# Altium schematic sheet Machine interlock controller.SchDoc: Machine interlock controller
size A3; Author: Peake J; CompanyName: Scion Research; DrawnBy: Peake J; Engineer: Peake J; Organization: Scion; Address1: 49 Sala St; Address2: Whakarewarewa; Address3: Rotorua; Address4: New Zealand 3010; DocumentNumber: N/A; Revision: 0; SheetNumber: 1; SheetTotal: 1
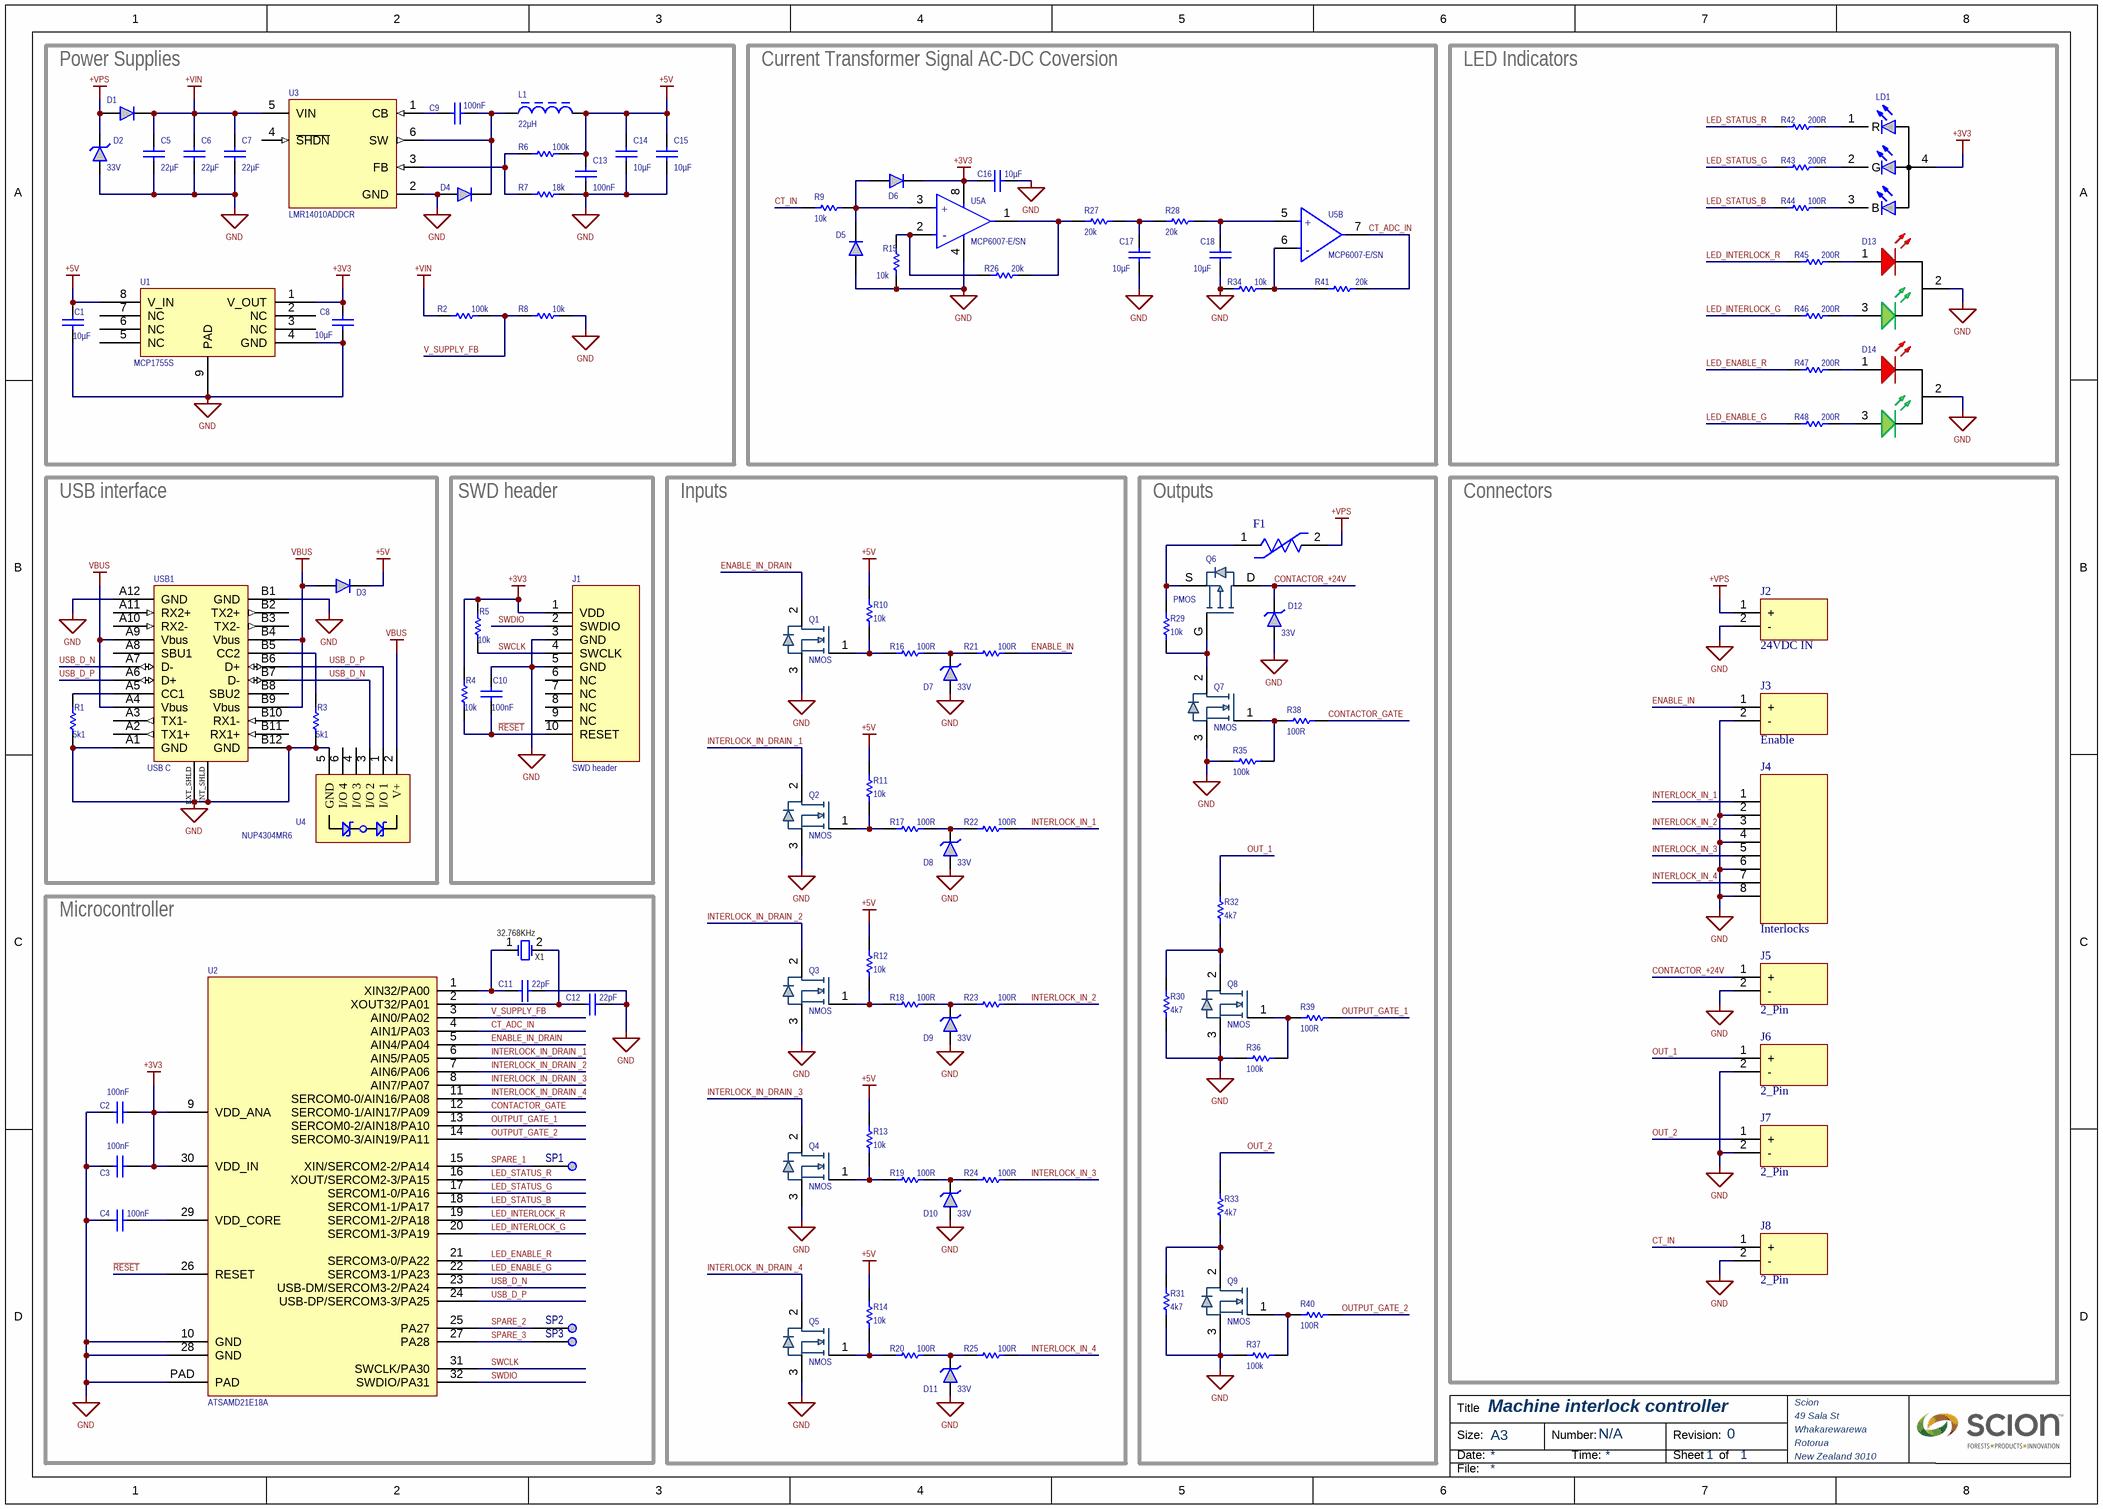
[diagram p0: Machine interlock controller.SchDoc]

## Parts
C1  value 10µF  [0603_CAP]  (hidden comment: Capacitor)
C2  value 100nF  [0603_CAP]  (hidden comment: Capacitor)
C3  value 100nF  [0603_CAP]  (hidden comment: Capacitor)
C4  value 100nF  [0603_CAP]  (hidden comment: Capacitor)
C5  value 22µF  [0805_CAP]  (hidden comment: Capacitor)
C6  value 22µF  [0805_CAP]  (hidden comment: Capacitor)
C7  value 22µF  [0805_CAP]  (hidden comment: Capacitor)
C8  value 10µF  [0603_CAP]  (hidden comment: Capacitor)
C9  value 100nF  [0603_CAP]  (hidden comment: Capacitor)
C10  value 100nF  [0603_CAP]  (hidden comment: Capacitor)
C11  value 22pF  [0603_CAP]  (hidden comment: Capacitor)
C12  value 22pF  [0603_CAP]  (hidden comment: Capacitor)
C13  value 100nF  [0603_CAP]  (hidden comment: Capacitor)
C14  value 10µF  [0603_CAP]  (hidden comment: Capacitor)
C15  value 10µF  [0603_CAP]  (hidden comment: Capacitor)
C16  value 10µF  [0603_CAP]  (hidden comment: Capacitor)
C17  value 10µF  [0603_CAP]  (hidden comment: Capacitor)
C18  value 10µF  [0603_CAP]  (hidden comment: Capacitor)
D1  Diode  [SOD-123]  (value not drawn)
D2  Rated Voltage: 33V  [SMBJ]  (hidden comment: Transil)
D3  Diode  [SOD-123]  (value not drawn)
D4  Diode  [SOD-123]  (value not drawn)
D5  Diode  [SOD-523]  (value not drawn)
D6  Diode  [SOD-523]  (value not drawn)
D7  Rated Voltage: 33V  [SMBJ]  (hidden comment: Transil)
D8  Rated Voltage: 33V  [SMBJ]  (hidden comment: Transil)
D9  Rated Voltage: 33V  [SMBJ]  (hidden comment: Transil)
D10  Rated Voltage: 33V  [SMBJ]  (hidden comment: Transil)
D11  Rated Voltage: 33V  [SMBJ]  (hidden comment: Transil)
D12  Rated Voltage: 33V  [SMBJ]  (hidden comment: Transil)
D13  LED 3mm Bi-colour  [LED 3mm Bi-colour-Footprint-1]  (value not drawn)
D14  LED 3mm Bi-colour  [LED 3mm Bi-colour-Footprint-1]  (value not drawn)
F1  0ZCF0100AF2A  [FP-0ZCF0100AF2A-MFG]  (value not drawn)
J1  SWD header  [DIP10_1.27_M_SMD]
J2  24VDC IN  [2P 3.81mm Header Plugable]
J3  Enable  [2P 3.81mm Header Plugable]
J4  Interlocks  [8P 3.81mm Header Plugable]
J5  2_Pin  [2P 3.81mm Header Plugable]
J6  2_Pin  [2P 3.81mm Header Plugable]
J7  2_Pin  [2P 3.81mm Header Plugable]
J8  2_Pin  [2P 3.81mm Header Plugable]
L1  value 22µH  [BOUR-SRN8040_V]  (hidden comment: Inductor)
LD1  LED_RGB_CA  [LED_RGB_CA]  (value not drawn)
Q1  NMOS  [SOT-23]
Q2  NMOS  [SOT-23]
Q3  NMOS  [SOT-23]
Q4  NMOS  [SOT-23]
Q5  NMOS  [SOT-23]
Q6  PMOS  [PowerDI 5060-8]
Q7  NMOS  [SOT-23]
Q8  NMOS  [SOT-23]
Q9  NMOS  [SOT-23]
R1  value 5k1  [0603_RES]  (hidden comment: Resistor)
R2  value 100k  [0603_RES]  (hidden comment: Resistor)
R3  value 5k1  [0603_RES]  (hidden comment: Resistor)
R4  value 10k  [0603_RES]  (hidden comment: Resistor)
R5  value 10k  [0603_RES]  (hidden comment: Resistor)
R6  value 100k  [0603_RES]  (hidden comment: Resistor)
R7  value 18k  [0603_RES]  (hidden comment: Resistor)
R8  value 10k  [0603_RES]  (hidden comment: Resistor)
R9  value 10k  [0603_RES]  (hidden comment: Resistor)
R10  value 10k  [0603_RES]  (hidden comment: Resistor)
R11  value 10k  [0603_RES]  (hidden comment: Resistor)
R12  value 10k  [0603_RES]  (hidden comment: Resistor)
R13  value 10k  [0603_RES]  (hidden comment: Resistor)
R14  value 10k  [0603_RES]  (hidden comment: Resistor)
R15  value 10k  [0603_RES]  (hidden comment: Resistor)
R16  value 100R  [0603_RES]  (hidden comment: Resistor)
R17  value 100R  [0603_RES]  (hidden comment: Resistor)
R18  value 100R  [0603_RES]  (hidden comment: Resistor)
R19  value 100R  [0603_RES]  (hidden comment: Resistor)
R20  value 100R  [0603_RES]  (hidden comment: Resistor)
R21  value 100R  [0603_RES]  (hidden comment: Resistor)
R22  value 100R  [0603_RES]  (hidden comment: Resistor)
R23  value 100R  [0603_RES]  (hidden comment: Resistor)
R24  value 100R  [0603_RES]  (hidden comment: Resistor)
R25  value 100R  [0603_RES]  (hidden comment: Resistor)
R26  value 20k  [0603_RES]  (hidden comment: Resistor)
R27  value 20k  [0603_RES]  (hidden comment: Resistor)
R28  value 20k  [0603_RES]  (hidden comment: Resistor)
R29  value 10k  [0603_RES]  (hidden comment: Resistor)
R30  value 4k7  [0603_RES]  (hidden comment: Resistor)
R31  value 4k7  [0603_RES]  (hidden comment: Resistor)
R32  value 4k7  [0603_RES]  (hidden comment: Resistor)
R33  value 4k7  [0603_RES]  (hidden comment: Resistor)
R34  value 10k  [0603_RES]  (hidden comment: Resistor)
R35  value 100k  [0603_RES]  (hidden comment: Resistor)
R36  value 100k  [0603_RES]  (hidden comment: Resistor)
R37  value 100k  [0603_RES]  (hidden comment: Resistor)
R38  value 100R  [0603_RES]  (hidden comment: Resistor)
R39  value 100R  [0603_RES]  (hidden comment: Resistor)
R40  value 100R  [0603_RES]  (hidden comment: Resistor)
R41  value 20k  [0603_RES]  (hidden comment: Resistor)
R42  value 200R  [0603_RES]  (hidden comment: Resistor)
R43  value 200R  [0603_RES]  (hidden comment: Resistor)
R44  value 100R  [0603_RES]  (hidden comment: Resistor)
R45  value 200R  [0603_RES]  (hidden comment: Resistor)
R46  value 200R  [0603_RES]  (hidden comment: Resistor)
R47  value 200R  [0603_RES]  (hidden comment: Resistor)
R48  value 200R  [0603_RES]  (hidden comment: Resistor)
SP1  CMP-00044-2  [Prog Pad 1.5 x 2.5mm]  (value not drawn)
SP2  CMP-00044-2  [Prog Pad 1.5 x 2.5mm]  (value not drawn)
SP3  CMP-00044-2  [Prog Pad 1.5 x 2.5mm]  (value not drawn)
U1  MCP1755S  [8P 2x3 DFN]
U2  ATSAMD21E18A  [32P QFN]
U3  LMR14010ADDCR  [FP-DDC0006A-IPC_A]
U4  NUP4304MR6  [TSOP-6]
U5  MCP6007-E/SN  [FP-C04-057-SN-IPC_A]  (parts A,B of 2)
USB1  USB C  [GT-USB-7090A]
X1  32.768KHz  [ABRA-ABS07-2_V]

## Blocks framed on the sheet
Power Supplies: C1 C5-C9 C13-C15 D1 D2 D4 L1 R2 R6-R8 U1 U3
Current Transformer Signal AC-DC Coversion: C16-C18 D5 D6 R9 R15 R26-R28 R34 R41 U5
LED Indicators: D13 D14 LD1 R42-R48
USB interface: D3 R1 R3 U4 USB1
SWD header: C10 J1 R4 R5
Inputs: D7-D11 Q1-Q5 R10-R14 R16-R25
Outputs: D12 F1 Q6-Q9 R29-R33 R35-R40
Connectors: J2-J8
Microcontroller: C2-C4 C11 C12 SP1-SP3 U2 X1

## Nets
+3V3: C2.1 C3.1 C8.1 C16.1 D6.1(K) J1.1(VDD) LD1.4(A) R4.1 R5.1 U1.1(V_OUT) U2.9(VDD_ANA) U2.30(VDD_IN) U5.8(VDD)
+5V: C1.1 C13.1 C14.1 C15.1 D3.1(K) L1.2 R6.2 R10.1 R11.1 R12.1 R13.1 R14.1 U1.8(V_IN)
+VIN: C5.1 C6.1 C7.1 D1.1(K) R2.1 U3.5(VIN)
+VPS: D1.2(A) D2.2(K) F1.2 J2.1(+)
GND: C1.2 C2.2 C3.2 C4.2 C5.2 C6.2 C7.2 C8.2 C10.1 C11.1 C12.2 C13.2 C14.2 C15.2 C16.2 C17.2 C18.2 D2.1(A) D4.2(A) D5.2(A) D7.1(A) D8.1(A) D9.1(A) D10.1(A) D11.1(A) D12.1(A) D13.2(Cathode) D14.2(Cathode) J1.3(GND) J1.5(GND) J2.2(-) J3.2(-) J4.2 J4.4 J4.6 J4.8 J5.2(-) J6.2(-) J7.2(-) J8.2(-) Q1.3(S) Q2.3(S) Q3.3(S) Q4.3(S) Q5.3(S) Q7.3(S) Q8.3(S) Q9.3(S) R1.2 R3.2 R7.2 R8.2 R15.2 R30.2 R31.2 R34.1 R35.1 R36.1 R37.1 U1.4(GND) U1.9(PAD) U2.10(GND) U2.28(GND) U2.PAD U3.2(GND) U4.5(GND) U5.4(VSS) USB1.A1(GND) USB1.A12(GND) USB1.B1(GND) USB1.B12(GND) USB1.EXT_SHLD USB1.INT_SHLD
VBUS: D3.2(A) U4.2(V+) USB1.A4(Vbus) USB1.A9(Vbus) USB1.B4(Vbus) USB1.B9(Vbus)
CONTACTOR_+24V: D12.2(K) J5.1(+) Q6.D
CONTACTOR_GATE: R38.2 U2.12(SERCOM0-1/AIN17/PA09)
CT_ADC_IN: R41.2 U2.4(AIN1/PA03) U5.7(VOUTB)
CT_IN: J8.1(+) R9.2
ENABLE_IN: J3.1(+) R21.2
ENABLE_IN_DRAIN: Q1.2(D) U2.5(AIN4/PA04)
INTERLOCK_IN_1: J4.1 R22.2
INTERLOCK_IN_2: J4.3 R23.2
INTERLOCK_IN_3: J4.5 R24.2
INTERLOCK_IN_4: J4.7 R25.2
INTERLOCK_IN_DRAIN _1: Q2.2(D) U2.6(AIN5/PA05)
INTERLOCK_IN_DRAIN _2: Q3.2(D) U2.7(AIN6/PA06)
INTERLOCK_IN_DRAIN _3: Q4.2(D) U2.8(AIN7/PA07)
INTERLOCK_IN_DRAIN _4: Q5.2(D) U2.11(SERCOM0-0/AIN16/PA08)
LED_ENABLE_G: R48.1 U2.22(SERCOM3-1/PA23)
LED_ENABLE_R: R47.1 U2.21(SERCOM3-0/PA22)
LED_INTERLOCK_G: R46.1 U2.20(SERCOM1-3/PA19)
LED_INTERLOCK_R: R45.1 U2.19(SERCOM1-2/PA18)
LED_STATUS_B: R44.1 U2.18(SERCOM1-1/PA17)
LED_STATUS_G: R43.1 U2.17(SERCOM1-0/PA16)
LED_STATUS_R: R42.1 U2.16(XOUT/SERCOM2-3/PA15)
OUT_1: J6.1(+) R32.1
OUT_2: J7.1(+) R33.1
OUTPUT_GATE_1: R39.2 U2.13(SERCOM0-2/AIN18/PA10)
OUTPUT_GATE_2: R40.2 U2.14(SERCOM0-3/AIN19/PA11)
~{RESET}: C10.2 J1.10(RESET) R4.2 U2.26(RESET)
SPARE_1: SP1.1 U2.15(XIN/SERCOM2-2/PA14)
SPARE_2: SP2.1 U2.25(PA27)
SPARE_3: SP3.1 U2.27(PA28)
SWCLK: J1.4(SWCLK) R5.2 U2.31(SWCLK/PA30)
SWDIO: J1.2(SWDIO) U2.32(SWDIO/PA31)
USB_D_N: U2.23(USB-DM/SERCOM3-2/PA24) U4.3(I/O_2) USB1.A7(D-) USB1.B7(D-)
USB_D_P: U2.24(USB-DP/SERCOM3-3/PA25) U4.1(I/O_1) USB1.A6(D+) USB1.B6(D+)
V_SUPPLY_FB: R2.2 R8.1 U2.3(AIN0/PA02)
NetC4_1: C4.1 U2.29(VDD_CORE)
NetC9_1: C9.1 D4.1(K) L1.1 U3.6(SW)
NetC9_2: C9.2 U3.1(CB)
NetC11_2: C11.2 U2.1(XIN32/PA00) X1.1(OSC1)
NetC12_1: C12.1 U2.2(XOUT32/PA01) X1.2(OSC2)
NetC17_1: C17.1 R27.2 R28.1
NetC18_1: C18.1 R28.2 U5.5(VINB+)
NetD5_1: D5.1(K) D6.2(A) R9.1 U5.3(VINA+)
NetD7_2: D7.2(K) R16.2 R21.1
NetD8_2: D8.2(K) R17.2 R22.1
NetD9_2: D9.2(K) R18.2 R23.1
NetD10_2: D10.2(K) R19.2 R24.1
NetD11_2: D11.2(K) R20.2 R25.1
NetD13_1: D13.1(Red_Annode) R45.2
NetD13_3: D13.3(Green_Annode) R46.2
NetD14_1: D14.1(Red_Annode) R47.2
NetD14_3: D14.3(Green_Annode) R48.2
NetF1_1: F1.1 Q6.S R29.1
NetLD1_1: LD1.1(R) R42.2
NetLD1_2: LD1.2(G) R43.2
NetLD1_3: LD1.3(B) R44.2
NetQ1_1: Q1.1(G) R10.2 R16.1
NetQ2_1: Q2.1(G) R11.2 R17.1
NetQ3_1: Q3.1(G) R12.2 R18.1
NetQ4_1: Q4.1(G) R13.2 R19.1
NetQ5_1: Q5.1(G) R14.2 R20.1
NetQ6_G: Q6.G Q7.2(D) R29.2
NetQ7_1: Q7.1(G) R35.2 R38.1
NetQ8_1: Q8.1(G) R36.2 R39.1
NetQ8_2: Q8.2(D) R30.1 R32.2
NetQ9_1: Q9.1(G) R37.2 R40.1
NetQ9_2: Q9.2(D) R31.1 R33.2
NetR1_1: R1.1 USB1.A5(CC1)
NetR3_1: R3.1 USB1.B5(CC2)
NetR6_1: R6.1 R7.1 U3.3(FB)
NetR15_1: R15.1 R26.1 U5.2(VINA-)
NetR26_2: R26.2 R27.1 U5.1(VOUTA)
NetR34_2: R34.2 R41.1 U5.6(VINB-)

Not connected (* = marked no-connect by the designer): J1 6(NC) 7(NC) 8(NC) 9(NC); U1 2(NC) 3(NC) 5(NC) 6(NC) 7(NC); U3 4(~{SHDN}); U4 4(I/O_3) 6(I/O_4); USB1 A2(TX1+) A3(TX1-) A8(SBU1) A10(RX2-) A11(RX2+) B2(TX2+) B3(TX2-) B8(SBU2) B10(RX1-) B11(RX1+)

## Notes on the sheet
- Title
- Size:
- Date:
- A3
- Number:
- Time:
- Revision:
- Sheet
- of
- File:
- (in symbol CMP-06302-000285-1, part A) +; -
- (in symbol CMP-06302-000285-1, part B) +; -

## Library data of the parts
C1-C18 = CMP-001-00172-2: SMD Capacitor; Pins: 2; Source: Discrete.SchLib; Design Item ID: Capacitor; Component Type: Standard
D1 D3-D6 = CMP-004-00083-4: SMD Diode; Design Item ID: Diode; Pins: 2; Source: Discrete.SchLib; Component Type: Standard; Pin Count: 2
D2 D7-D12 = CMP-079-000108-2: Transient Voltage Suppressor; MFN: SMBJ33A; Component Type: Standard; Pin Count: 2; Source: Discrete.SchLib; Breakdown Voltage: *; Design Item ID: Transil; Clamping Voltage: *
D13 D14 = CMP-004-00052-2: Lite-on LTL1BEKVJNN; Source: All Components - 30.06.23 - 18.27.SchLib; Component Type: Standard; Pin Count: 3; Design Item ID: CMP-00043-1
F1 = CMP-005-00014-2: PTC Resettable Fuse 100A 0.5s 60VDC 0.09 Ohm 2-Pin 2920 T/R; Time to Trip: 500ms; Hold Current: 1A; Trip Current: 2A; Pins: 2; Component Type: Standard; Thickness: 0.067inch; Width: 0.202inch; Series: 0ZCF; Max Operating Temperature: 85°C; Source: All Components - 30.06.23 - 18.27.SchLib; Min Operating Temperature: -40°C; Design Item ID: CMP-00051-1; Length: 0.29inch; Case/Package: 2920; RoHS Compliant: Yes; Packaging: Cut Tape; Max Current Rating: 100A; Case Code (Metric): 7351; Mount: Surface Mount
J1 = CMP-002-00170-1: 10 Pin Connector; Component Type: Standard; Pins: 10; Source: Connectors.SchLib; Pin Count: 10; Design Item ID: 10_Pin
J2 J3 J5-J8 = CMP-002-00173-1: 2 Pin Connector; Design Item ID: 2_Pin; Pins: 2; Pin Count: 2; MFN: *; Component Type: Standard; Source: Connectors.SchLib
J4 = CMP-002-00183-2: 8 Pin Connector; Pin Count: 8; Design Item ID: 8_Pin; Component Type: Standard; Pins: 8; Source: Connectors.SchLib
L1 = CMP-006-00052-2: Power Inductor; DCR: 100mR; Current Rating: 2.2A; Pins: 2; Component Type: Standard; Design Item ID: Inductor; Source: Discrete.SchLib; Pin Count: 2; MFN: *
LD1 = CMP-007-00085-1: Common Annode SMD RGB LED; Design Item ID: LED_RGB_CA; Pins: 4; Component Type: Standard; Source: Discrete.SchLib
Q1-Q5 Q7-Q9 = CMP-079-000093-2: N Channel MOSFET; Design Item ID: NMOS; Source: N-MOS.SchLib; MFN: *; Pin Count: 3; Component Type: Standard
Q6 = CMP-079-000102-2: P Channel MOSFET; MFN: *; Design Item ID: PMOS GDS; VGS Max: *; Continuous Current: *; VDS Breakdown: *; Source: P-MOS.SchLib; Component Type: Standard; Pin Count: 3
R1 R3 = CMP-009-00356-1: SMD Resistor; Value: 5k1; Pins: 2; Source: Discrete.SchLib; Component Type: Standard; Design Item ID: Resistor
R2 R4-R48 = CMP-009-00356-1: SMD Resistor; Pins: 2; Source: Discrete.SchLib; Component Type: Standard; Design Item ID: Resistor
SP1-SP3 = CMP-079-000036-1: Programmer pogo-pin interface pad (or test pad); Source: All Components - 30.06.23 - 18.27.SchLib; Component Type: Standard; Pin Count: 1; Design Item ID: CMP-00044-2
U1 = CMP-079-000090-2: LDO Linear Voltage Regulator; Pin Count: 9; Component Type: Standard; Source: Microchip.SchLib; Design Item ID: MCP1755S
U2 = CMP-079-000006-3: ATMEL         ATSAMD21E17A-MU            32 Bit Microcontroller, SAM D Series, ARM Cortex-M0+, 48 MHz, 128 KB, 16 KB, 32 Pins, QFN; Data Bus Width: 32b; RAM Size: 16KB; Number of I/Os: 26; Number of Timers/Counters: 6; Max Frequency: 48MHz; Memory Size: 128KB; Watchdog Timer: Yes; Min Supply Voltage: 1.62V; Operating Supply Voltage: 3.3V; Peripherals: Brown-out Detect/Reset,POR,PWM,WDT,DMA; Memory Type: FLASH; Max Supply Voltage: 3.63V; Interface: I2C,SPI,UART,USART,LIN,USB,I2S; Oscillator Type: Internal; Speed: 48RPM; Clock Frequency: 32MHz; Packaging: Tray; Max Operating Temperature: 85°C; Number of Programmable I/O: 26; Min Operating Temperature: -40°C; RoHS Compliant: Yes; Frequency: 48MHz; Core Architecture: ARM; Mount: Surface Mount; Lead Free: Lead Free; Number of Pins: 32; REACH SVHC: No SVHC; Contact Plating: Tin,Matte; Case/Package: QFN; Pin Count: 33; Design Item ID: CMP-00013-1; Component Type: Standard; Source: All Components - 30.06.23 - 18.27.SchLib; Nominal Supply Voltage: 3.3V; Terminal Pitch: 0.5mm; Number of I/O Lines: 26; Package Style: CHIP CARRIER, HEAT SINK/SLUG, VERY THIN PROFILEMeter; Terminal Form: No Lead; Height - Seated (Max): 1mm; Technology: CMOS; JESD-30 Code: S-XQCC-N32; Pins: 32; Terminal Position: QUAD; Width: 5mm; Surface Mount: Yes; Temperature Grade: AUTOMOTIVE; Length: 5mm; Package Shape: Square
U3 = CMP-079-000005-5: 7-40VDC-DC buck converter; Number of Outputs: 1; Max Output Voltage: 40V; Output Current: 1A; Min Input Voltage: 4V; Output Type: Adjustable; Synchronous Rectifier: No; Min Output Voltage: 765mV; Output Configuration: Positive; Switching Frequency: 850kHz; Max Operating Temperature: 125°C; Case/Package: SOT-23-6; Features: UVLO; Pin Count: 6; Packaging: Cut Tape; Mount: Surface Mount; Component Type: Standard; Min Operating Temperature: -40°C; Max Input Voltage: 40V; Source: All Components - 30.06.23 - 18.27.SchLib; Design Item ID: CMP-00007-1
U4 = CMP-079-000096-2: ESD Protection Doide Array; Design Item ID: NUP4304MR6; Pin Count: 6; Component Type: Standard; Source: ON Semi.SchLib
U5 = CMP-06302-000285-1: IC OPAMP GP 2 CIRCUIT 8SOIC; RoHS Compliant: Yes
USB1 = CMP-079-000004-3: Vertical or RA Type C Usb Connector Rohs Compliant: Yes; Pin Count: 26; Design Item ID: CMP-00005-5; Source: All Components - 30.06.23 - 18.27.SchLib; Component Type: Standard
X1 = CMP-003-00061-3: Low Profile Crystal, 32.768 kHz, +/- 20 ppm, 12.5 pF, -40 to 85 degC, 2-Pin SMD, Pb-Free, Tape and Reel; Manufacturer: Abracon; Tolerance: 20ppm; Load Capacitance: 12.5pF; ESR: 70k; Case/Package: CSMD; Datasheet Version: Aug-15; Pins: 2; Max Operating Temperature: 85°C; Package Description: 2-Pin Surface Mount Device, Body 3.2 x 1.5 mm; Manufacturer URL: http://www.abracon.com/; Package URL: http://www.abracon.com/Support/PackageDrawing/Resonators/ABS07.PDF; Min Operating Temperature: -40°C; Packaging: TapeandReel; RoHS Compliant: True; Package Reference: ABS07-2; Frequency Tolerance: 20ppm; Frequency: 32.768kHz; Datasheet URL: http://www.abracon.com/Resonators/ABS07.pdf; Package Quantity: 3000; Mounting Technology: SM; Component Type: Standard; Source: All Components - 30.06.23 - 18.27.SchLib; Design Item ID: CMP-003-00022-1